# Altium schematic sheet MIXR Processing - STM32 USB-UART Converter.SchDoc: STM32F767 DSP Microcontroller - USB - UART
size B; Organization: Midnight Sun Solar Rayce Car Team; Address1: University of Waterloo; Address2: 200 University Ave W; Address3: Waterloo, ON, Canada; Address4: N2L 3E9; DocumentNumber: 13; SheetNumber: 13; SheetTotal: 15; Website: www.uwmidsun.com; ProjectName: ProjectName
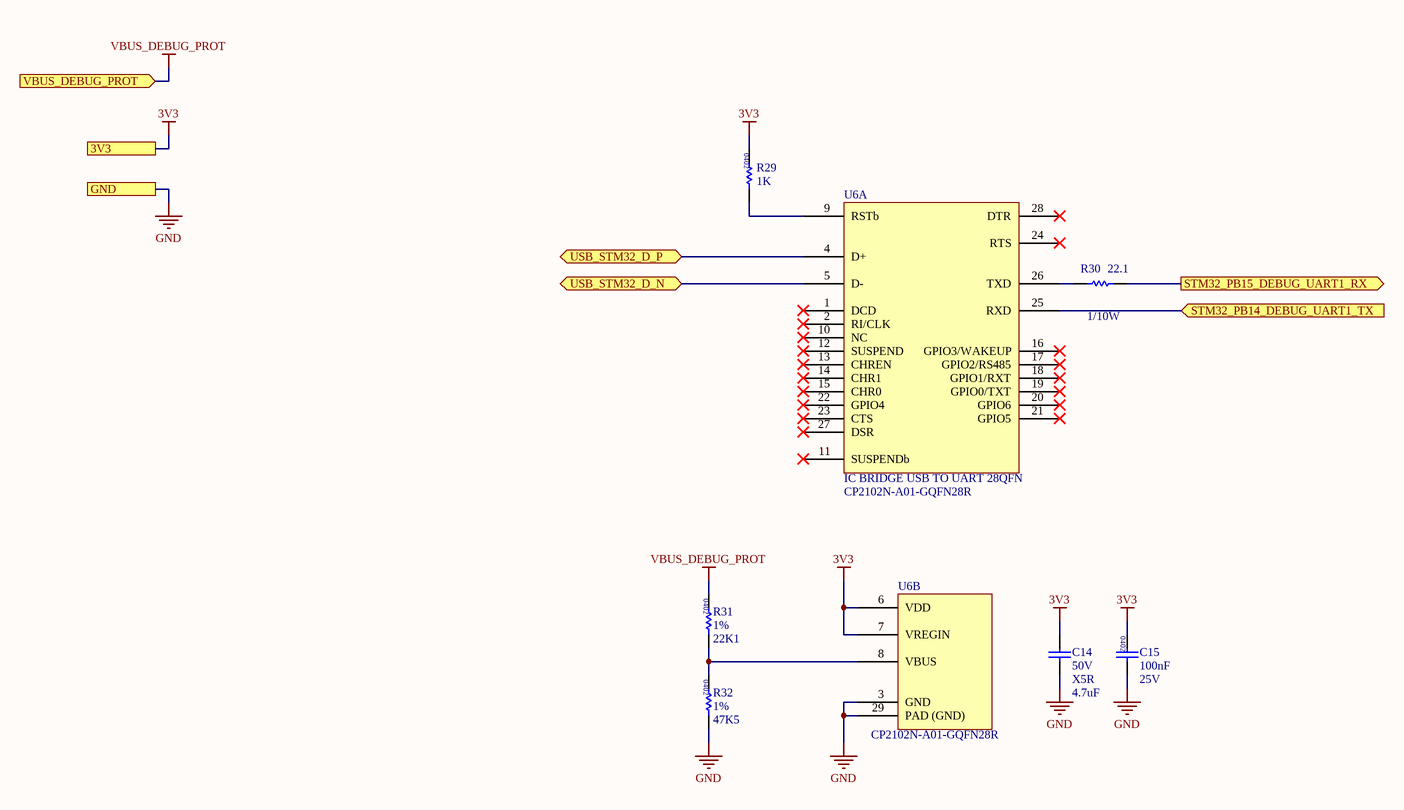
[diagram p0: MIXR Processing - STM32 USB-UART Converter.SchDoc]

## Parts
C14  value 4.7uF  Voltage - Rated: 50V  Temperature Coefficient: X5R  [CAP, 0805]  (hidden comment: CAP CER 4.7UF 50V 10% X5R 0805)
C15  Capacitance: 100nF  Voltage: 25V  [CAP 0402]  (hidden comment: CAP CER 0.1UF 16V X7R 0402)
R29  Resistance: 1K  [RES 0402]  (hidden comment: RES 1K OHM 0.1% 1/16W 0402)
R30  Resistance: 22.1  Power: 1/10W  [RES, 0603]  (hidden comment: RES 22.1 OHM 1% 1/10W 0603)
R31  Tolerance: 1%  Resistance: 22K1  [RES 0402]  (hidden comment: RES 22.1K OHM 1% 1/16W 0402)
R32  Tolerance: 1%  Resistance: 47K5  [RES 0402]  (hidden comment: RES 47.5K OHM 1% 1/16W 0402)
U6  IC BRIDGE USB TO UART 28QFN  Manufacturer Part Number: CP2102N-A01-GQFN28R  [QFN50P500X500X80_HS-29M]  (parts A,B of 2)

## Ports
3V3, GND, STM32_PB14_DEBUG_UART1_TX (in), STM32_PB15_DEBUG_UART1_RX (out), USB_STM32_D_N (bidir), USB_STM32_D_P (bidir), VBUS_DEBUG_PROT (in)

## Nets
3V3: C14.1 C15.1 R29.1 U6.6(VDD) U6.7(VREGIN) ; port 3V3
GND: C14.2 C15.2 R32.2 U6.3(GND) U6.29(PAD_(GND)) ; port GND
VBUS_DEBUG_PROT: R31.1 ; port VBUS_DEBUG_PROT
STM32_PB14_DEBUG_UART1_TX: U6.25(RXD) ; port STM32_PB14_DEBUG_UART1_TX
STM32_PB15_DEBUG_UART1_RX: R30.2 ; port STM32_PB15_DEBUG_UART1_RX
USB_STM32_D_N: U6.5(D-) ; port USB_STM32_D_N
USB_STM32_D_P: U6.4(D+) ; port USB_STM32_D_P
NetR29_2: R29.2 U6.9(RSTb)
NetR30_1: R30.1 U6.26(TXD)
NetR31_2: R31.2 R32.1 U6.8(VBUS)

Not connected (* = marked no-connect by the designer): U6 1(DCD)* 2(RI/CLK)* 10(NC)* 11(SUSPENDb)* 12(SUSPEND)* 13(CHREN)* 14(CHR1)* 15(CHR0)* 16(GPIO3/WAKEUP)* 17(GPIO2/RS485)* 18(GPIO1/RXT)* 19(GPIO0/TXT)* 20(GPIO6)* 21(GPIO5)* 22(GPIO4)* 23(CTS)* 24(RTS)* 27(DSR)* 28(DTR)*

## Notes on the sheet
- PROJECT
- DOCUMENT
- DRAWN BY
- LAST MODIFIED
- PART NUMBER
- REVISION
- SHEET
- VARIANT
- OF

## Library data of the parts
C14 = CAP CER 4.7UF 50V 10% X5R 0805: 4.7µF ±20% 50V Ceramic Capacitor X5R 0805 (2012 Metric); Manufacturer 1: Murata Electronics North America; Manufacturer Part Number 1: GRT21BR61H475ME13L; Description 1: CAP CER 4.7UF 50V X5R 0805; Supplier 1: Digi-Key; Supplier Part Number 1: 490-12395-1-ND; RoHS: RoHS Compliant; Category: Capacitors; Stock 1: 4286; Pricing 1: 1=0.56, 10=0.389, 100=0.2338, 500=0.17536, 1000=0.14808 (CAD); Packaging: Cut Tape (CT); Part Status: Active; Tolerance: ±20%; Operating Temperature: -55°C ~ 85°C; Features: -; Ratings: AEC-Q200; Applications: Automotive; Mounting Type: Surface Mount, MLCC; Package / Case: 0805 (2012 Metric); Size / Dimension: 0.079" L x 0.049" W (2.00mm x 1.25mm); Height - Seated (Max): -; Thickness (Max): 0.057" (1.45mm); Lead Spacing: -; Lead Style: -; ComponentLink1URL: http://search.murata.co.jp/Ceramy/image/img/A01X/G101/ENG/GRT21BR61H475ME13-01.pdf; ComponentLink1Description: http://search.murata.co.jp/Ceramy/image/img/A01X/G101/ENG/GRT21BR61H475ME13-01.pdf
C15 = CAP CER 0.1UF 16V X7R 0402: Cap Ceramic 0.1uF 25V X7R 10% SMD 0402 125C Paper T/R; Manufacturer: Murata; Manufacturer Part Number: GRM155R71E104KE14D; Supplier 1: Digi-Key; Supplier Part Number 1: 490-10698-1-ND; Packaging: Tape and Reel; ComponentLink1URL: http://www.farnell.com/datasheets/2048008.pdf?src-supplier=Farnell; ComponentLink1Description: http://www.farnell.com/datasheets/2048008.pdf?src-supplier=Farnell; Tolerance: 10%; RoHS: Yes; Category: Ceramic Capacitors; Stock 1: 785540; Pricing 1: 1=0.10000, 10=0.03400, 100=0.01520, 500=0.01088, 1000=0.00855, 2500=0.00778, 5000=0.00715 (USD); Mount: Surface Mount; Case/Package: 0402; Weight: 0.000212oz; Case Code (Metric): 1005; Case Code (Imperial): 0402; Dielectric Material: Ceramic; Min Operating Temperature: -55°C; Max Operating Temperature: 125°C; Termination: SMD/SMT; Composition: Ceramic; Voltage Rating (DC): 25V; Package Quantity: 10000; Length: 1mm; Height: 0.5mm; Width: 0.02inch; Thickness: 0.022inch; Depth: 0.5mm; REACH SVHC: Unknown; Lead Free: Lead Free; ComponentLink2URL: http://uk.rs-online.com/webdocs/144c/0900766b8144c113.pdf?src-supplier=RSComponents; ComponentLink2Description: http://uk.rs-online.com/webdocs/144c/0900766b8144c113.pdf?src-supplier=RSComponents; ComponentLink3URL: http://www.farnell.com/datasheets/1872206.pdf?src-supplier=Farnell; ComponentLink3Description: http://www.farnell.com/datasheets/1872206.pdf?src-supplier=Farnell; ComponentLink4URL: http://components.arrow.com/part/dataview/0323_06361249?src-supplier=Arrow+Europe; ComponentLink4Description: http://components.arrow.com/part/dataview/0323_06361249?src-supplier=Arrow+Europe; ComponentLink5URL: http://www.mouser.com/ds/2/281/c02e-2905.pdf?src-supplier=Mouser; ComponentLink5Description: http://www.mouser.com/ds/2/281/c02e-2905.pdf?src-supplier=Mouser; ComponentLink6URL: http://www.farnell.com/datasheets/2048008.pdf?src-supplier=Newark; ComponentLink6Description: http://www.farnell.com/datasheets/2048008.pdf?src-supplier=Newark; ComponentLink7URL: http://psearch.en.murata.com/capacitor/product/GRM155R71E104KE14%23.pdf?src-supplier=Avnet; ComponentLink7Description: http://psearch.en.murata.com/capacitor/product/GRM155R71E104KE14%23.pdf?src-supplier=Avnet; ComponentLink8URL: https://search.murata.co.jp/Ceramy/image/img/A01X/G101/ENG/GRM155R71E104KE14-01.pdf?src-supplier=Digi-Key; ComponentLink8Description: https://search.murata.co.jp/Ceramy/image/img/A01X/G101/ENG/GRM155R71E104KE14-01.pdf?src-supplier=Digi-Key; ComponentLink9URL: http://www.farnell.com/datasheets/2048008.pdf?src-supplier=Element14; ComponentLink9Description: http://www.farnell.com/datasheets/2048008.pdf?src-supplier=Element14; Dielectric: X7R; Voltage Rating: 25V
R29 = RES 1K OHM 0.1% 1/16W 0402: RES SMD 1K OHM 0.1% 1/16W 0402; Manufacturer: Yageo; Manufacturer Part Number: RT0402BRE071KL; Temperature Coefficient: 50ppm/°C; Power Rating: 62.5mW; Voltage Rating: 50V; Max Power Dissipation: 63mW; Supplier 1: Digi-Key; Supplier Part Number 1: YAG2306CT-ND; RoHS: Yes; Category: Chip SMD Resistors; Stock 1: 46127; Pricing 1: 1=0.41000, 10=0.29200, 100=0.11690, 1000=0.05758, 2500=0.05335, 5000=0.04827 (USD); Packaging: Tape and Reel; Tolerance: 0.1%; Composition: Thin Film; Features: Moisture Resistant; ComponentLink1URL: https://datasheet.ciiva.com/2582/pyu-rt-1-to-0-05-rohs-l-5-2582672.pdf?src-supplier=Digi-Key; ComponentLink1Description: https://datasheet.ciiva.com/2582/pyu-rt-1-to-0-05-rohs-l-5-2582672.pdf?src-supplier=Digi-Key; Case/Package: 0402; Weight: 2.3E-05oz; Case Code (Metric): 1005; Case Code (Imperial): 0402; Min Operating Temperature: -55°C; Max Operating Temperature: 125°C; Package Quantity: 10000; Number of Terminations: 2; Termination: SMD/SMT; Military Standard: Not; Voltage Rating (DC): 50V; Length: 1mm; Height: 0.014inch; Width: 0.02inch; Depth: 0.5mm; Lead Free: Lead Free; ComponentLink2URL: https://datasheet.ciiva.com/12796/pyu-rt-1-to-0-05-rohs-l-4-12796476.pdf?src-supplier=Mouser; ComponentLink2Description: https://datasheet.ciiva.com/12796/pyu-rt-1-to-0-05-rohs-l-4-12796476.pdf?src-supplier=Mouser
R30 = RES 22.1 OHM 1% 1/10W 0603: 22.1 Ohm ±1% 0.1W, 1/10W Chip Resistor 0603 (1608 Metric) Moisture Resistant Thick Film; Manufacturer 1: Yageo; Manufacturer Part Number 1: RC0603FR-0722R1L; Temperature Coefficient: ±100ppm/°C; Supplier 1: Digi-Key; Supplier Part Number 1: 311-22.1HRCT-ND; Packaging: Cut Tape (CT); Composition: Thick Film; ComponentLink1URL: http://www.yageo.com/documents/recent/PYu-RC_Group_51_RoHS_L_7.pdf; ComponentLink1Description: http://www.yageo.com/documents/recent/PYu-RC_Group_51_RoHS_L_7.pdf; Tolerance: ±1%; Part Status: Active; Operating Temperature: -55°C ~ 155°C; Package / Case: 0603 (1608 Metric); Supplier Device Package: 0603; Size / Dimension: 0.063" L x 0.031" W (1.60mm x 0.80mm); Height - Seated (Max): 0.022" (0.55mm); Failure Rate: -
R31 = RES 22.1K OHM 1% 1/16W 0402: RES SMD 22.1K OHM 1% 1/16W 0402; Manufacturer: Stackpole Electronics; Manufacturer Part Number: RMCF0402FT22K1; Max Power Dissipation: 63mW; Temperature Coefficient: 100ppm/°C; Supplier 1: Digi-Key; RoHS: Yes; Category: Chip SMD Resistors; Stock 1: 130160; Pricing 1: 1=0.10000, 10=0.01400, 100=0.00580, 1000=0.00262, 2500=0.00228, 5000=0.00188 (USD); Mount: Surface Mount; Case/Package: 0402; Case Code (Metric): 1005; Case Code (Imperial): 0402; Contact Plating: Tin,Matte; Min Operating Temperature: -55°C; Max Operating Temperature: 155°C; Packaging: Tape and Reel; Composition: Thick Film; Number of Terminations: 2; Features: Automotive AEC-Q200; Length: 0.039inch; Height: 0.016inch; Width: 0.02inch; Radiation Hardening: No; Lead Free: Lead Free; ComponentLink1URL: http://components.arrow.com/part/dataview/50500388S32218N1174?src-supplier=Arrow; ComponentLink1Description: http://components.arrow.com/part/dataview/50500388S32218N1174?src-supplier=Arrow; ComponentLink2URL: https://www.seielect.com/Catalog/SEI-RMCF_RMCP.pdf?src-supplier=Digi-Key; ComponentLink2Description: https://www.seielect.com/Catalog/SEI-RMCF_RMCP.pdf?src-supplier=Digi-Key; ComponentLink3URL: https://www.seielect.com/catalog/SEI-RMCF_RMCP.pdf?src-supplier=Avnet; ComponentLink3Description: https://www.seielect.com/catalog/SEI-RMCF_RMCP.pdf?src-supplier=Avnet; ComponentLink4URL: https://www.seielect.com/catalog/SEI-Packaging.pdf?src-supplier=Digi-Key; ComponentLink4Description: https://www.seielect.com/catalog/SEI-Packaging.pdf?src-supplier=Digi-Key; Supplier Part Number 1: RMCF0402FT22K1CT-ND
R32 = RES 47.5K OHM 1% 1/16W 0402: RES SMD 47.5K OHM 1% 1/16W 0402; Manufacturer: Yageo; Manufacturer Part Number: RC0402FR-0747K5L; Power Rating: 62.5mW; Temperature Coefficient: 100ppm/°C; Voltage Rating: 50V; Supplier 1: Digi-Key; RoHS: Yes; Category: Chip SMD Resistors; Stock 1: 1151028; Pricing 1: 1=0.10000, 10=0.01600, 100=0.00640, 1000=0.00289, 2500=0.00251, 5000=0.00207 (USD); Case/Package: 0402; Case Code (Metric): 1005; Case Code (Imperial): 0402; Min Operating Temperature: -55°C; Max Operating Temperature: 155°C; Packaging: Tape and Reel; Composition: Thick Film; Military Standard: Not; Length: 1mm; Depth: 0.5mm; Lead Free: Lead Free; ComponentLink1URL: https://datasheet.ciiva.com/16746/pyu-rc0402-51-rohs-l-6-r-16746316.pdf?src-supplier=Future+Electronics; ComponentLink1Description: https://datasheet.ciiva.com/16746/pyu-rc0402-51-rohs-l-6-r-16746316.pdf?src-supplier=Future+Electronics; Supplier Part Number 1: 311-47.5KLRCT-ND; Termination: SMD/SMT; Voltage Rating (DC): 50V; REACH SVHC: No SVHC; ComponentLink2URL: https://datasheet.ciiva.com/46394/1018594-46394942.pdf?src-supplier=Element14; ComponentLink2Description: https://datasheet.ciiva.com/46394/1018594-46394942.pdf?src-supplier=Element14; ComponentLink3URL: https://datasheet.ciiva.com/12667/pyu-rc0402-51-rohs-l-6-r-12667103.pdf?src-supplier=Mouser; ComponentLink3Description: https://datasheet.ciiva.com/12667/pyu-rc0402-51-rohs-l-6-r-12667103.pdf?src-supplier=Mouser
U6 = IC BRIDGE USB TO UART 28QFN: Manufacturer: Silicon Labs; Supplier 1: Digi-Key; RoHS: No; Stock 1: 2155; Pricing 1: 1=1.40000, 25=1.35160, 100=1.29950 (USD); ComponentLink1URL: https://www.silabs.com/documents/public/data-sheets/cp2102n-datasheet.pdf?src-supplier=Digi-Key; ComponentLink1Description: https://www.silabs.com/documents/public/data-sheets/cp2102n-datasheet.pdf?src-supplier=Digi-Key; Supplier Part Number 1: 336-4738-1-ND